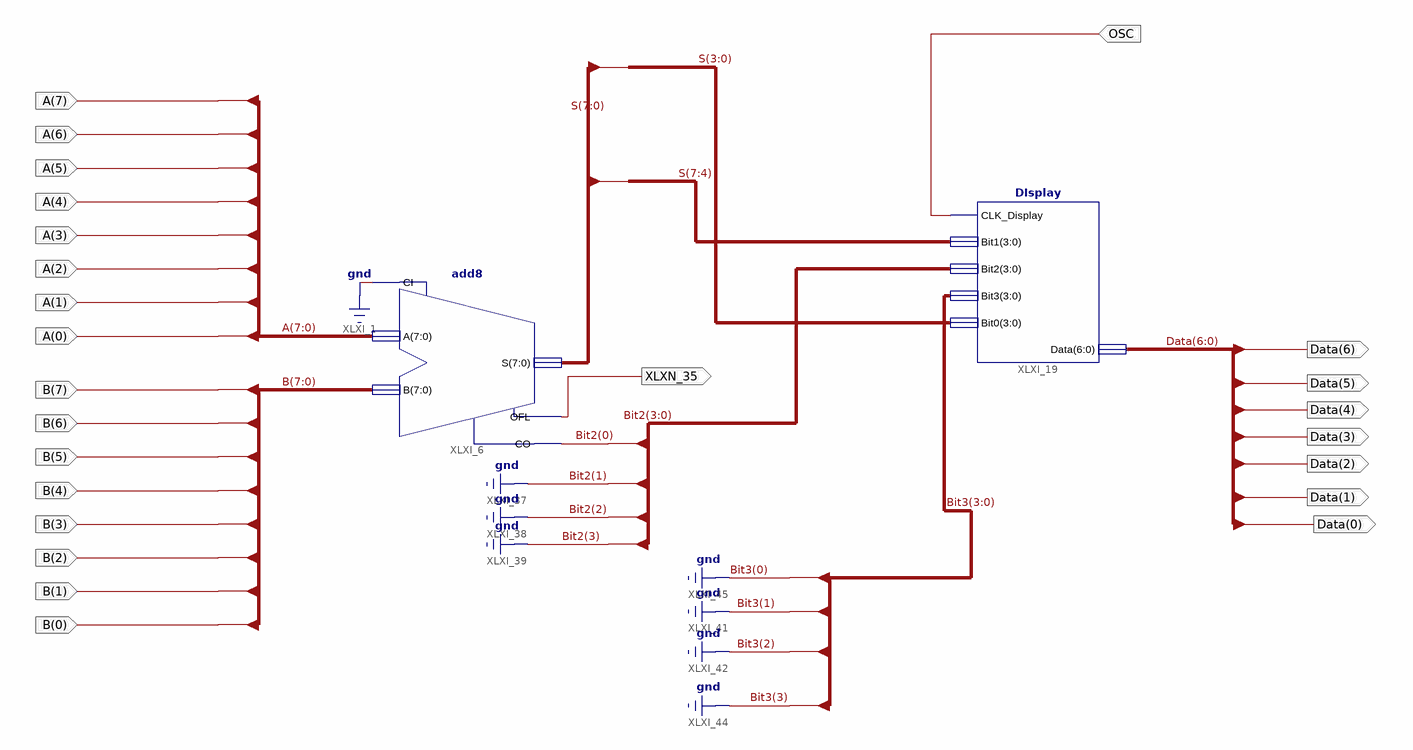
[diagram p0: schematic sheet 1]
// Xilinx ISE schematic fullCircuit.sch (spartan6) as structural Verilog: 2 symbols, 25 ports
module fullCircuit (
  input  [7:0] A,
  input  [7:0] B,
  input  OSC,
  output XLXN_35,
  output [6:0] Data
);

  wire [0:0] Bit2;
  wire [7:0] S;

  add8 XLXI_6 (.A(A), .B(B), .CI(1'b0), .CO(Bit2[0]), .OFL(XLXN_35), .S(S));
  DIsplay XLXI_19 (
    .CLK_Display(OSC), .Bit1(S[7:4]), .Bit2({3'b000, Bit2[0]}), .Bit3(4'b0000), .Bit0(S[3:0]), .Data(Data));
endmodule
